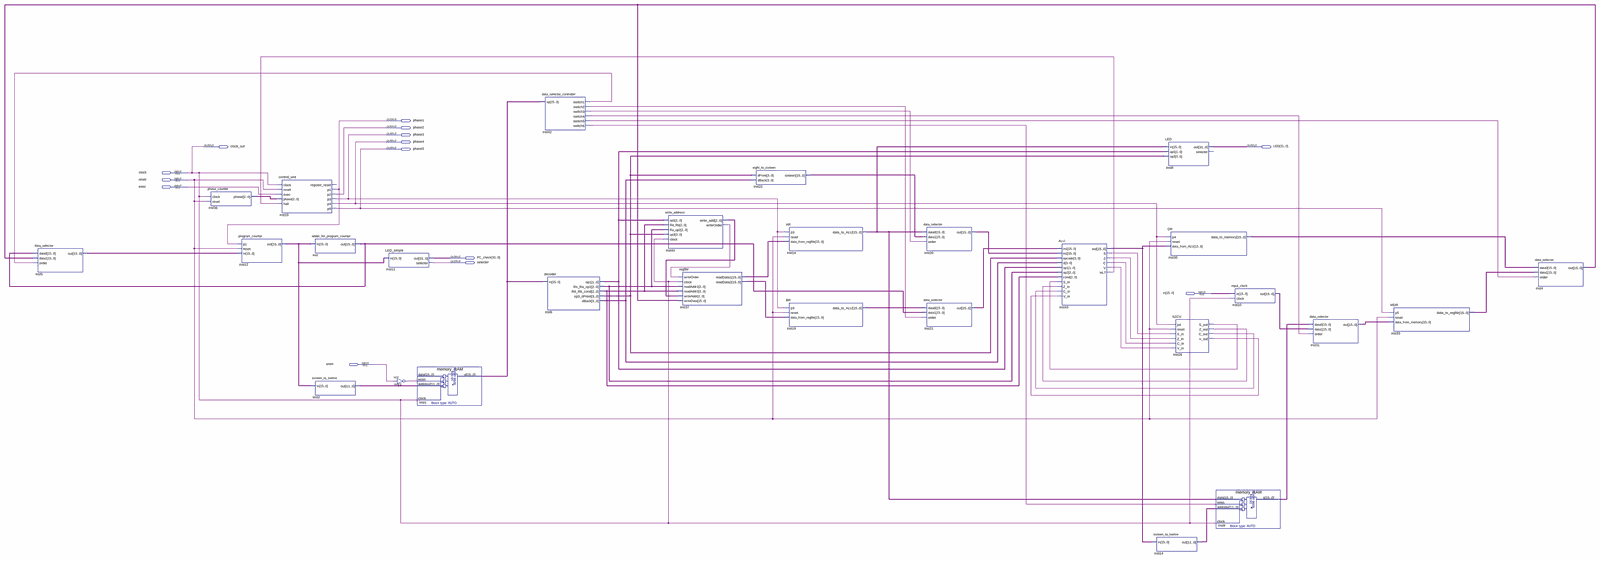
[diagram p0: schematic sheet, whole]
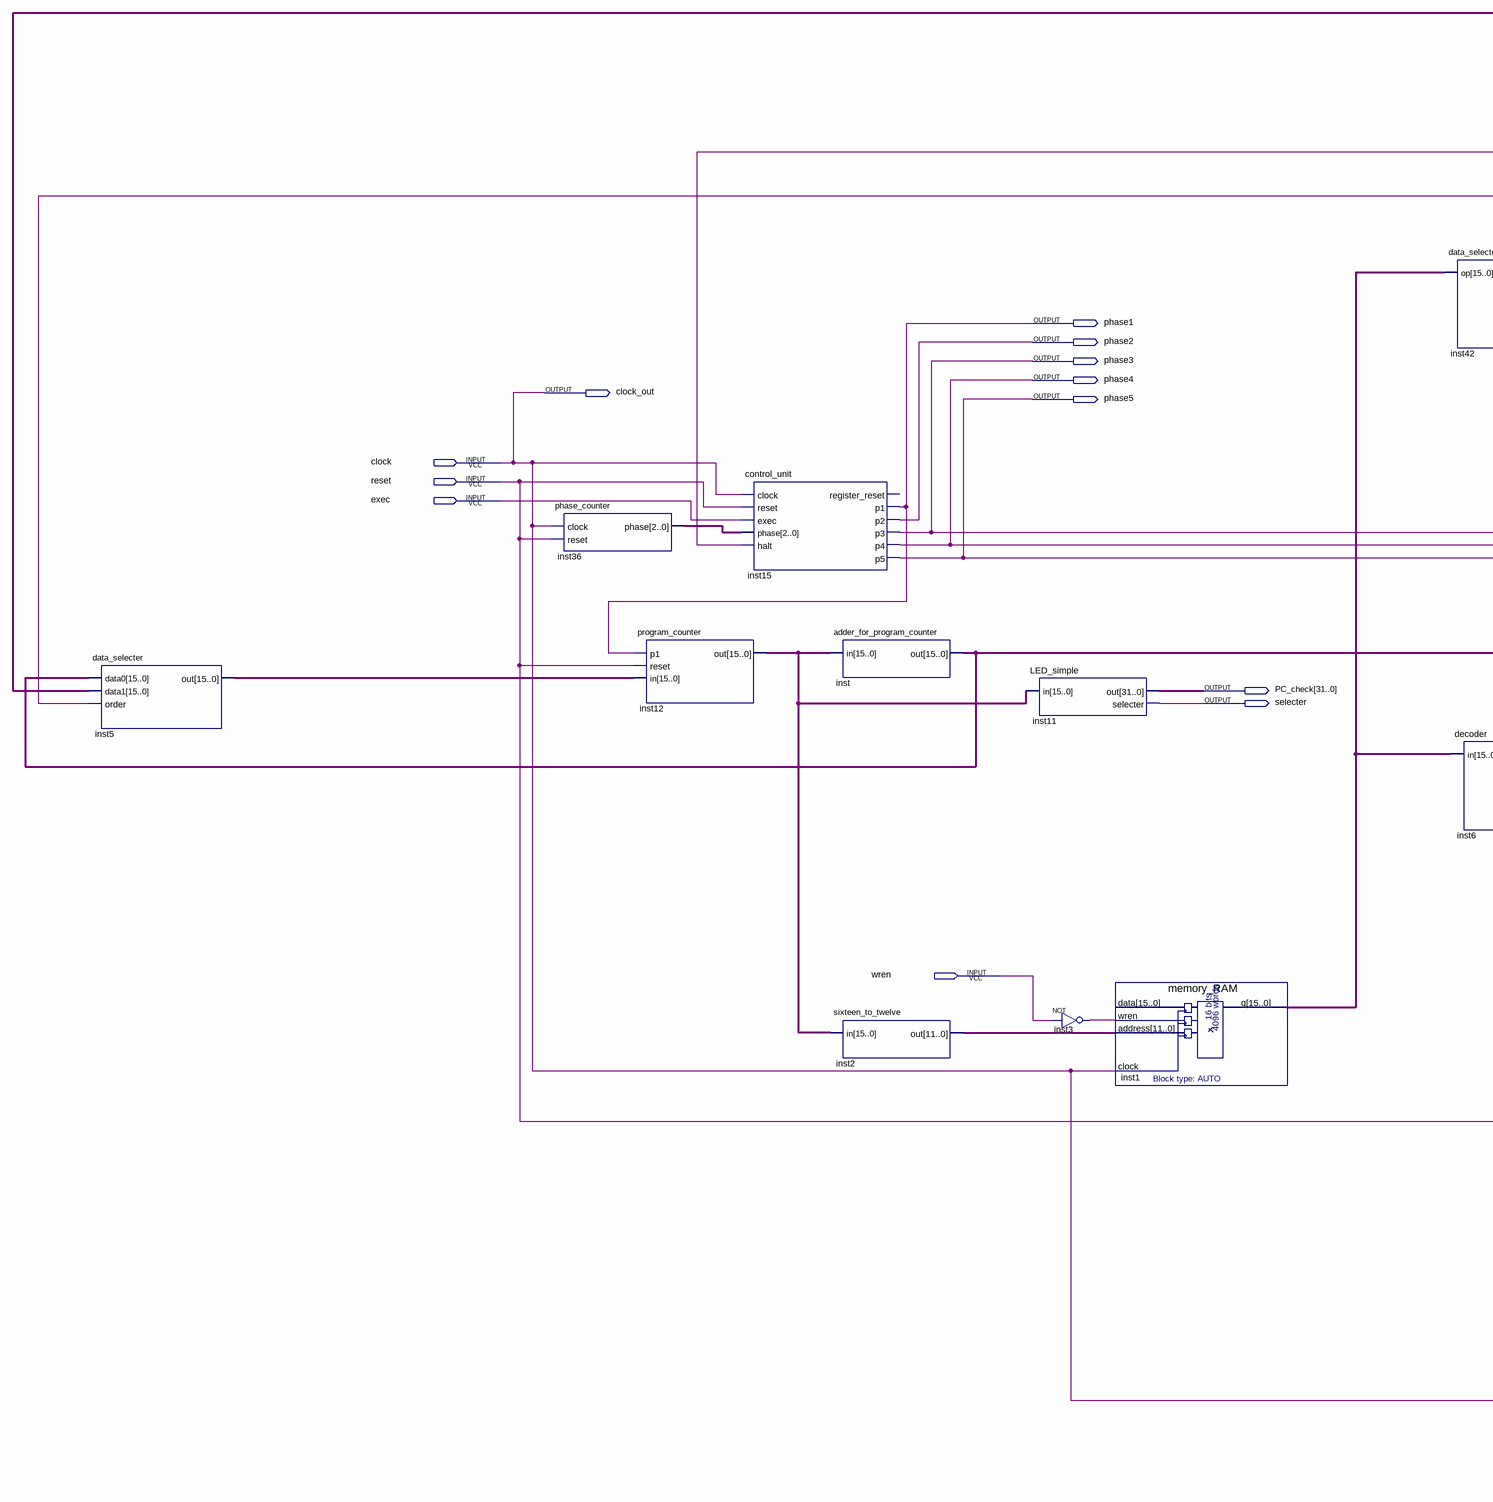
[diagram p1: schematic sheet, left part]
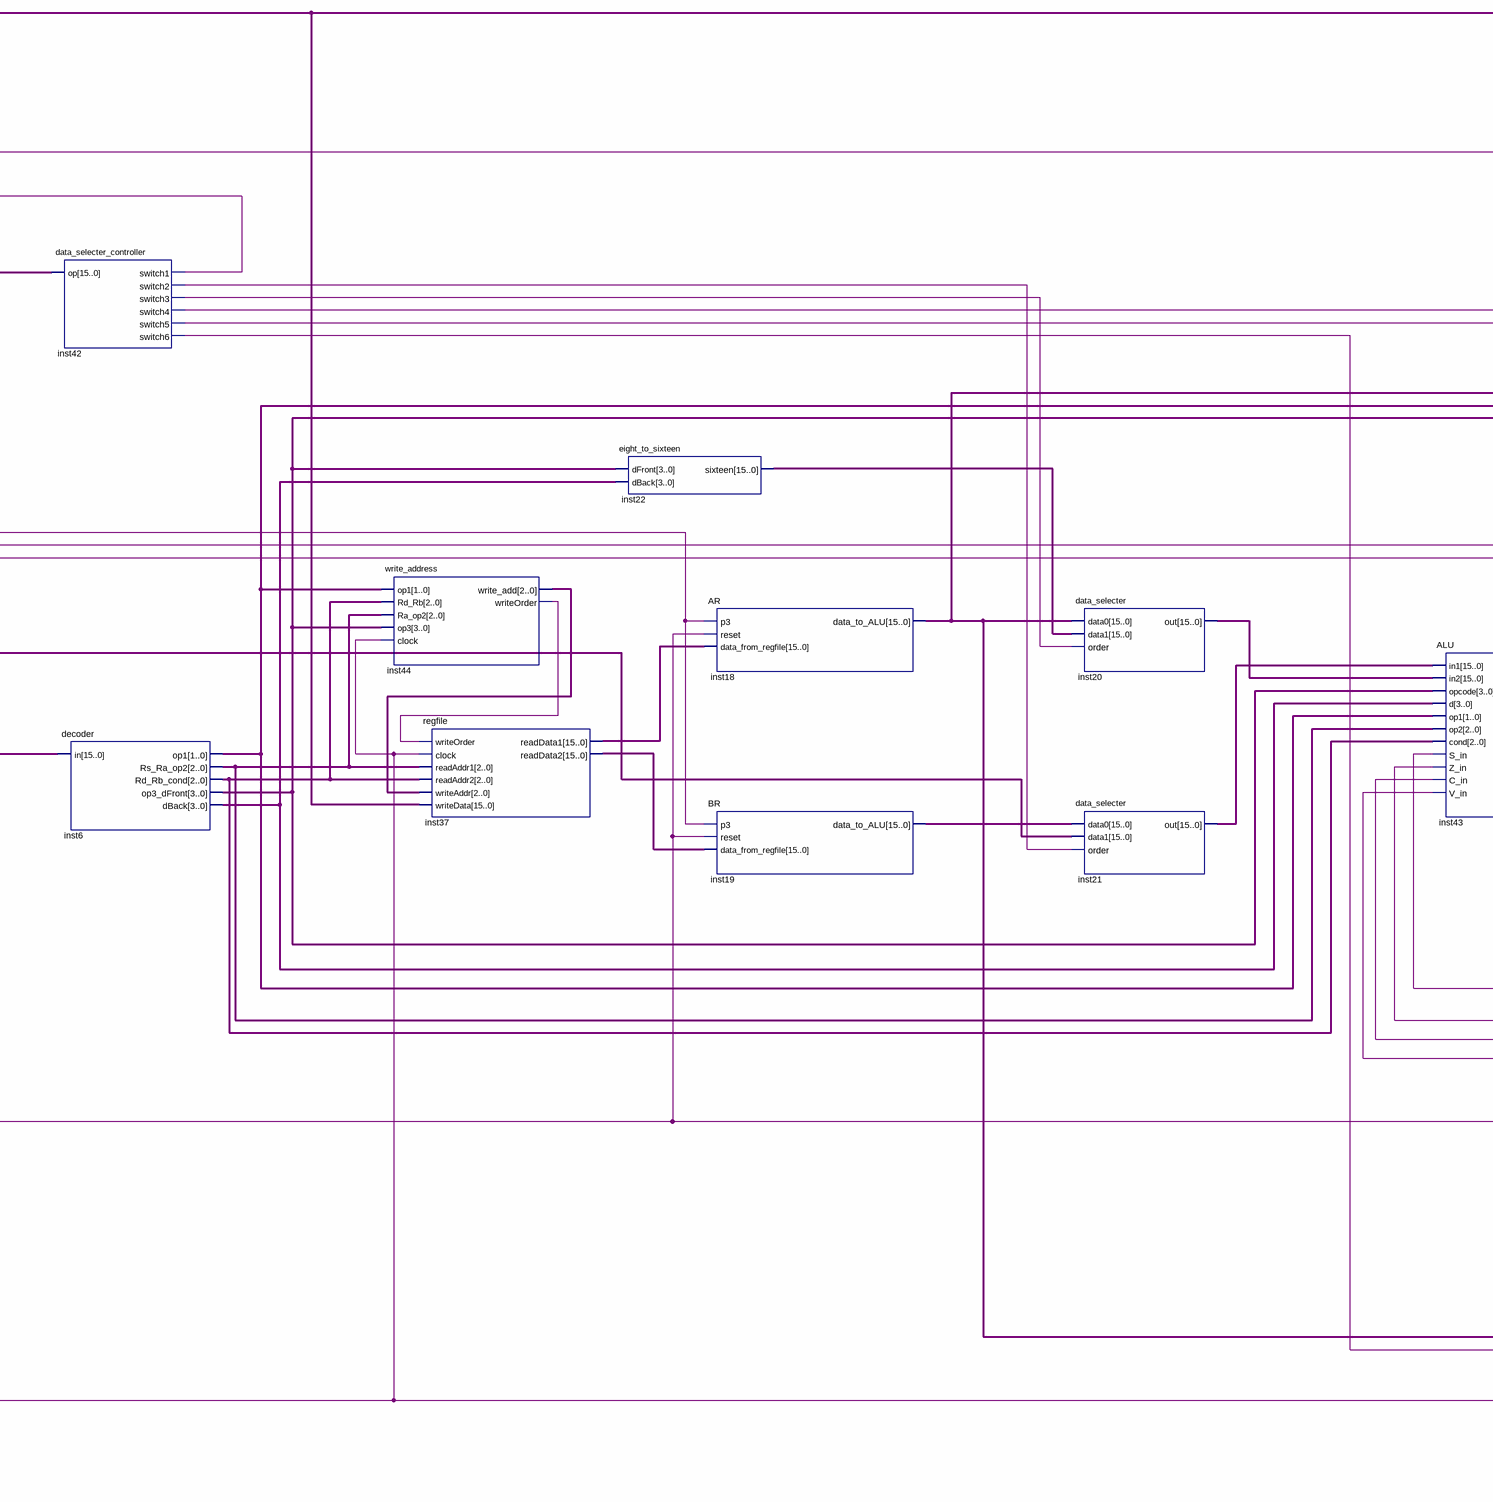
[diagram p2: schematic sheet, centre part]
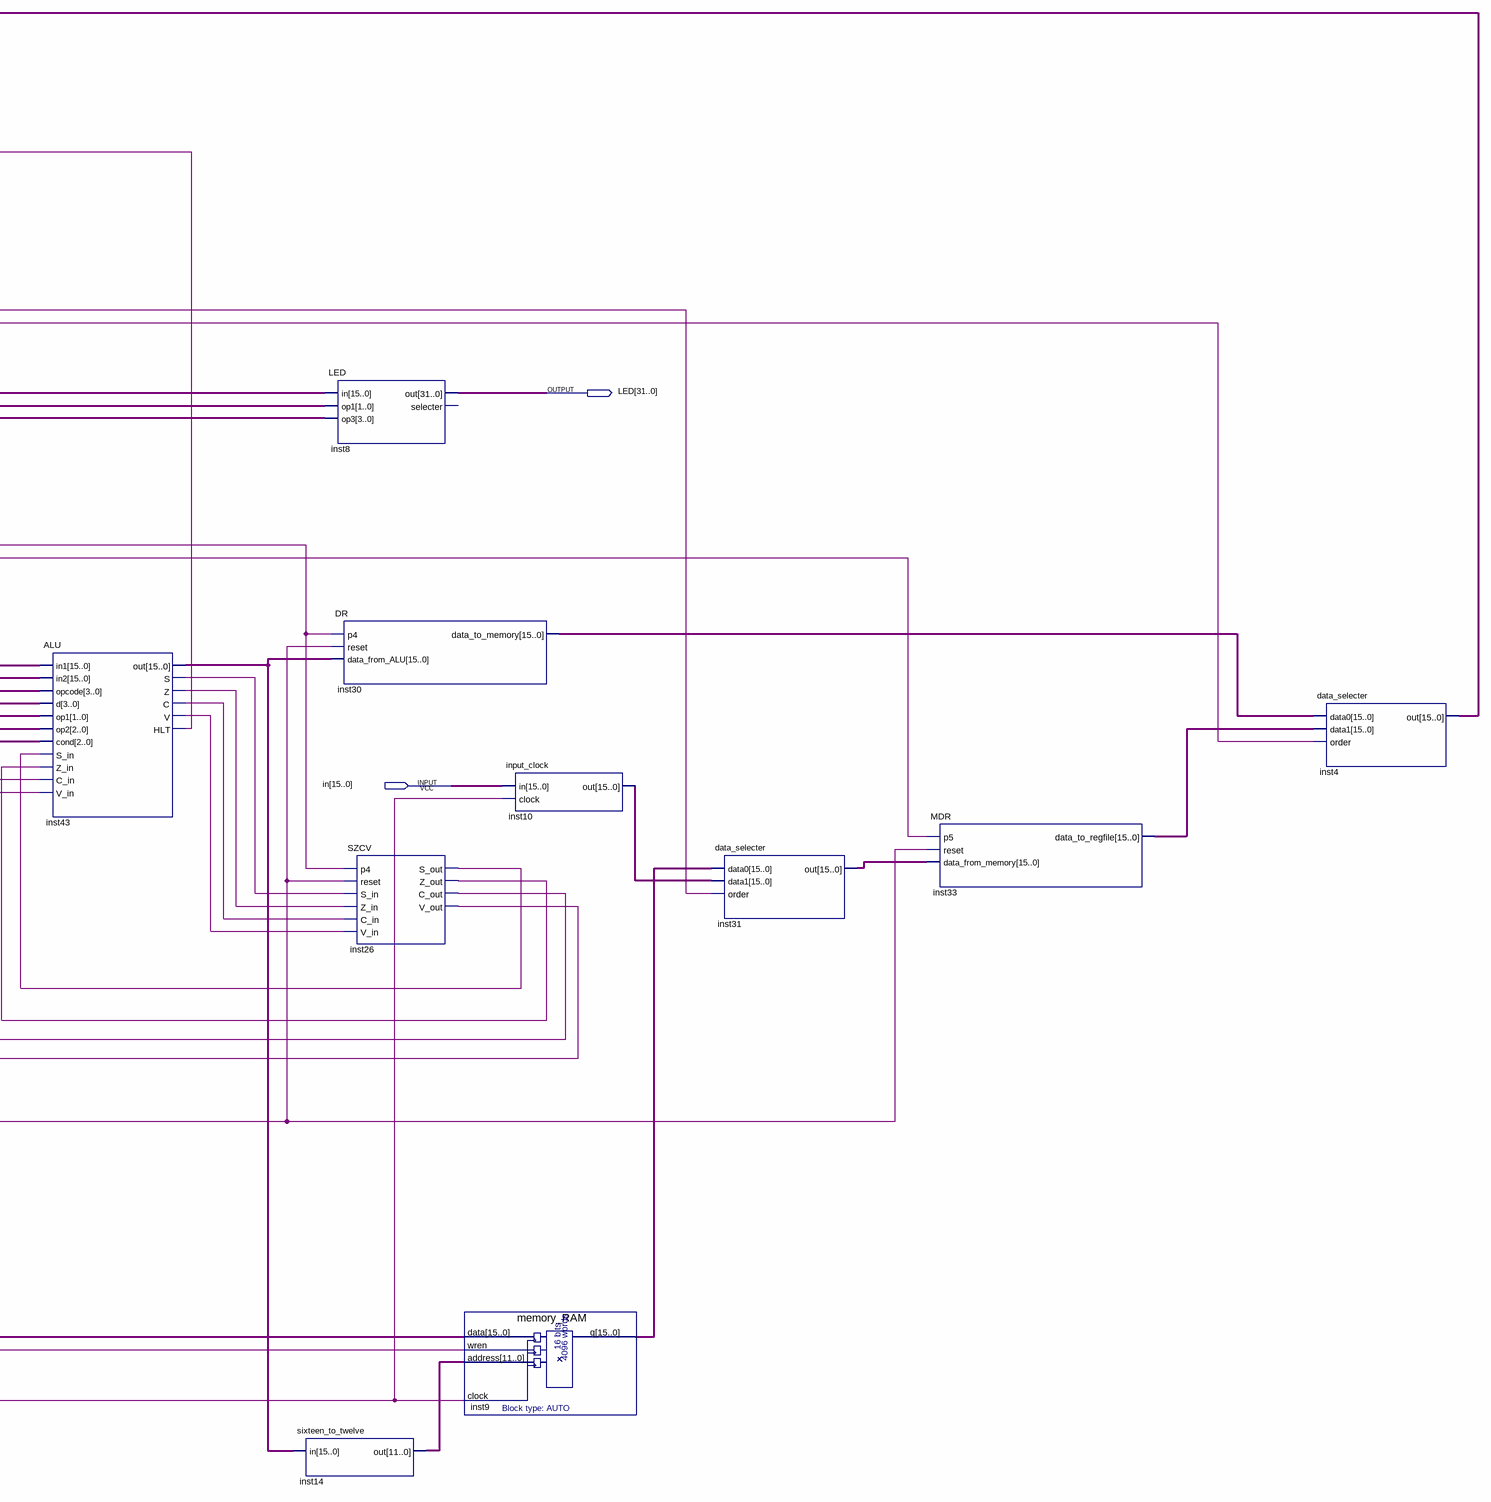
[diagram p3: schematic sheet, right part]
// Quartus schematic processor_p5.bdf as structural Verilog: 28 symbols, 14 pins
module processor_p5 (
  input  clock,
  input  reset,
  input  exec,
  input  [15:0] in,
  input  wren,
  output phase1,
  output phase2,
  output phase3,
  output phase4,
  output clock_out,
  output [31:0] LED,
  output phase5,
  output [31:0] PC_check,
  output selecter
);

  wire inst3_out, inst26_c_out, inst26_s_out, inst26_v_out, inst26_z_out, inst42_switch1, inst42_switch2,
       inst42_switch3, inst42_switch4, inst42_switch5, inst42_switch6, inst43_c, inst43_hlt, inst43_s,
       inst43_v, inst43_z, inst44_writeorder;
  wire [1:0] inst6_op1;
  wire [2:0] inst6_rd_rb_cond, inst6_rs_ra_op2, inst36_phase, inst44_write_add;
  wire [3:0] inst6_dback, inst6_op3_dfront;
  wire [11:0] inst2_out, inst14_out;
  wire [15:0] inst1_q, inst4_out, inst5_out, inst9_q, inst10_out, inst12_out, inst18_data_to_alu,
       inst19_data_to_alu, inst20_out, inst21_out, inst22_sixteen, inst30_data_to_memory, inst31_out,
       inst33_data_to_regfile, inst37_readdata1, inst37_readdata2, inst43_out, inst_out;

  data_selecter inst5 (.data0(inst_out), .data1(inst4_out), .order(inst42_switch1), .out(inst5_out));
  phase_counter inst36 (.clock(clock), .reset(reset), .phase(inst36_phase));
  program_counter inst12 (.p1(phase1), .reset(reset), .in(inst5_out), .out(inst12_out));
  control_unit inst15 (
    .clock(clock), .reset(reset), .exec(exec), .phase(inst36_phase), .halt(inst43_hlt), .p1(phase1),
    .p2(phase2), .p3(phase3), .p4(phase4), .p5(phase5));  // open: register_reset
  adder_for_program_counter inst (.in(inst12_out), .out(inst_out));
  sixteen_to_twelve inst2 (.in(inst12_out), .out(inst2_out));
  LED_simple inst11 (.in(inst12_out), .out(PC_check), .selecter(selecter));
  not inst3 (inst3_out, wren);
  memory_RAM inst1 (.wren(inst3_out), .address(inst2_out), .clock(clock), .q(inst1_q));  // open: data
  data_selecter_controller inst42 (
    .op(inst1_q), .switch1(inst42_switch1), .switch2(inst42_switch2), .switch3(inst42_switch3),
    .switch4(inst42_switch4), .switch5(inst42_switch5), .switch6(inst42_switch6));
  decoder inst6 (
    .in(inst1_q), .op1(inst6_op1), .Rs_Ra_op2(inst6_rs_ra_op2), .Rd_Rb_cond(inst6_rd_rb_cond),
    .op3_dFront(inst6_op3_dfront), .dBack(inst6_dback));
  write_address inst44 (
    .op1(inst6_op1), .Rd_Rb(inst6_rd_rb_cond), .Ra_op2(inst6_rs_ra_op2), .op3(inst6_op3_dfront),
    .clock(clock), .write_add(inst44_write_add), .writeOrder(inst44_writeorder));
  regfile inst37 (
    .writeOrder(inst44_writeorder), .clock(clock), .readAddr1(inst6_rs_ra_op2), .readAddr2(inst6_rd_rb_cond),
    .writeAddr(inst44_write_add), .writeData(inst4_out), .readData1(inst37_readdata1),
    .readData2(inst37_readdata2));
  eight_to_sixteen inst22 (.dFront(inst6_op3_dfront), .dBack(inst6_dback), .sixteen(inst22_sixteen));
  AR inst18 (.p3(phase3), .reset(reset), .data_from_regfile(inst37_readdata1), .data_to_ALU(inst18_data_to_alu));
  BR inst19 (.p3(phase3), .reset(reset), .data_from_regfile(inst37_readdata2), .data_to_ALU(inst19_data_to_alu));
  data_selecter inst20 (.data0(inst18_data_to_alu), .data1(inst22_sixteen), .order(inst42_switch3), .out(inst20_out));
  data_selecter inst21 (.data0(inst19_data_to_alu), .data1(inst_out), .order(inst42_switch2), .out(inst21_out));
  ALU inst43 (
    .in1(inst21_out), .in2(inst20_out), .opcode(inst6_op3_dfront), .d(inst6_dback), .op1(inst6_op1),
    .op2(inst6_rs_ra_op2), .cond(inst6_rd_rb_cond), .S_in(inst26_s_out), .Z_in(inst26_z_out),
    .C_in(inst26_c_out), .V_in(inst26_v_out), .out(inst43_out), .S(inst43_s), .Z(inst43_z), .C(inst43_c),
    .V(inst43_v), .HLT(inst43_hlt));
  sixteen_to_twelve inst14 (.in(inst43_out), .out(inst14_out));
  LED inst8 (.in(inst18_data_to_alu), .op1(inst6_op1), .op3(inst6_op3_dfront), .out(LED));  // open: selecter
  DR inst30 (.p4(phase4), .reset(reset), .data_from_ALU(inst43_out), .data_to_memory(inst30_data_to_memory));
  SZCV inst26 (
    .p4(phase4), .reset(reset), .S_in(inst43_s), .Z_in(inst43_z), .C_in(inst43_c), .V_in(inst43_v),
    .S_out(inst26_s_out), .Z_out(inst26_z_out), .C_out(inst26_c_out), .V_out(inst26_v_out));
  memory_RAM inst9 (.data(inst18_data_to_alu), .wren(inst42_switch6), .address(inst14_out), .clock(clock), .q(inst9_q));
  input_clock inst10 (.in(in), .clock(clock), .out(inst10_out));
  data_selecter inst31 (.data0(inst9_q), .data1(inst10_out), .order(inst42_switch4), .out(inst31_out));
  MDR inst33 (.p5(phase5), .reset(reset), .data_from_memory(inst31_out), .data_to_regfile(inst33_data_to_regfile));
  data_selecter inst4 (
    .data0(inst30_data_to_memory), .data1(inst33_data_to_regfile), .order(inst42_switch5), .out(inst4_out));

  assign clock_out = clock;
endmodule
